# EasyEDA Pro project EthernetModule.epro

# Schematic Ethernet Mode
Board Name: Board2; Create Date: 2026-04-15; Page Name: P1; Project Name: ESP32_Buspirate_complete; Schematic Name: Ethernet Mode; Update Date: 2026-04-15; Company: EasyEDA.com; Page Size: A4; Version: V1.0
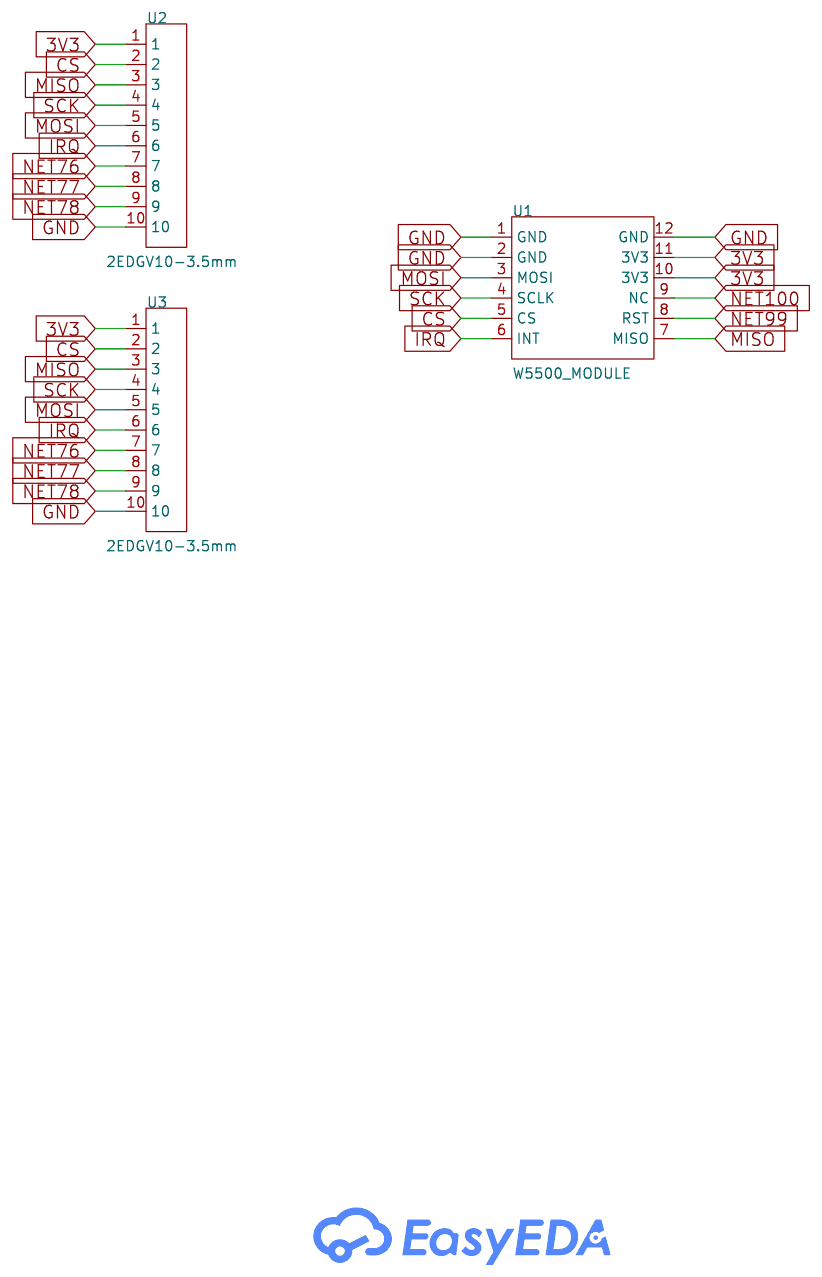
[diagram p0: schematic sheet]

## Parts
U1  W5500_MODULE  [COMM-TH_L25.0-W23.0_W5500_MODULE]
U2  2EDGV10-3.5mm  [CONN-TH_10P-P2.50_B10B-EH-A-LF-SN]
U3  2EDGV10-3.5mm  [CONN-TH_10P-P2.50_B10B-EH-A-LF-SN]

## Library data of the parts
U1 = W5500_MODULE_LAN: Supplier Part: C9900227168; JLCPCB Part Class: Extended Part; Supplier: LCSC
U2 U3 = CONN-TH_10P-P3.50: Supplier Part: C9900014909; Supplier Footprint: 2EDG_10p_3.5mm; JLCPCB Part Class: Extended Part; Supplier: LCSC

## Nets
3V3: U1.10(3V3) U1.11(3V3) U2.1 U3.1
GND: U1.1(GND) U1.2(GND) U1.12(GND) U2.10 U3.10
CS: U1.5(CS) U2.2 U3.2
IRQ: U1.6(INT) U2.6 U3.6
MISO: U1.7(MISO) U2.3 U3.3
MOSI: U1.3(MOSI) U2.5 U3.5
NET76: U2.7 U3.7
NET77: U2.8 U3.8
NET78: U2.9 U3.9
NET99: U1.8(RST)
NET100: U1.9(NC)
SCK: U1.4(SCLK) U2.4 U3.4

# Board PCB4
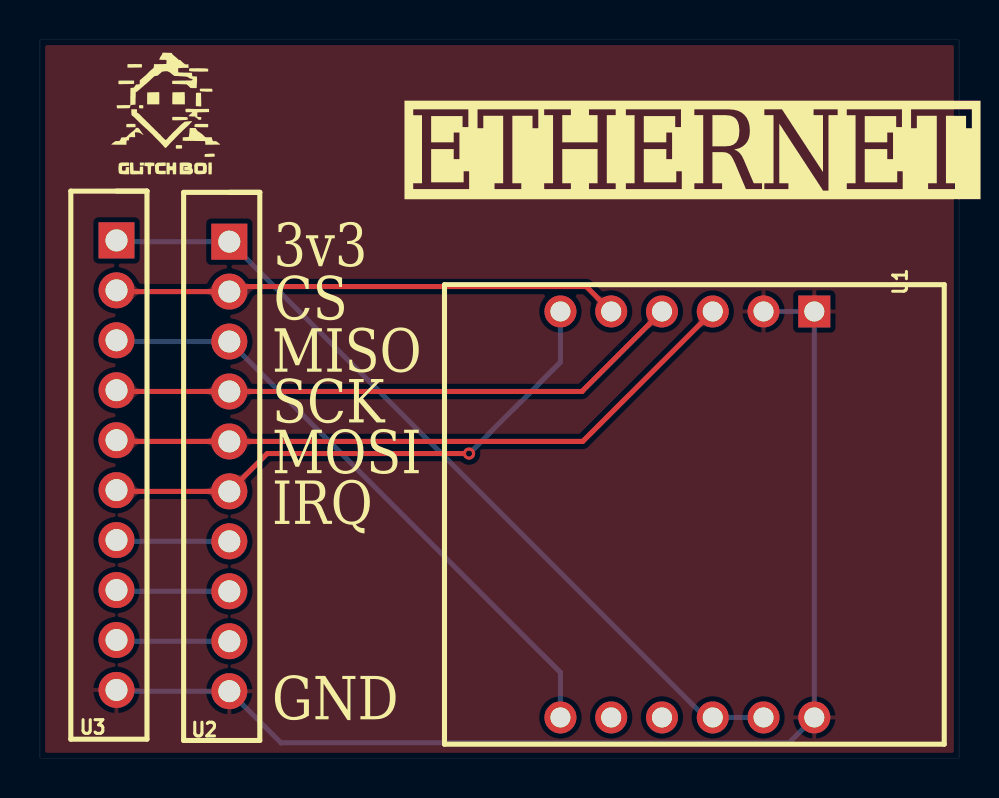
[diagram p1: board, top side]
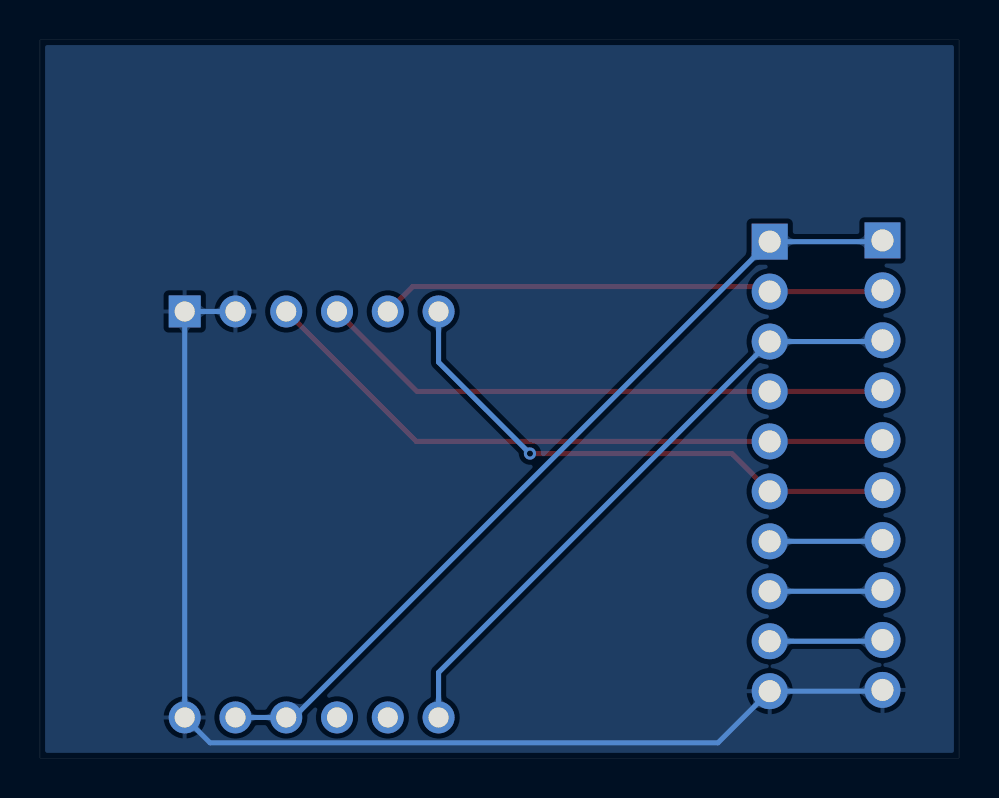
[diagram p2: board, bottom side, seen from below]

Outline 45.97 x 35.94 mm; copper layers: Top Layer, Bottom Layer. Coordinates in mm from the lower left corner of the outline.
Outline path: rectangle 0,35.94 45.97,0
Stack: Top Layer 0.035mm / Dielectric1 1.51mm FR4 er 4.5 / Bottom Layer 0.035mm

## Design rules (mm)
template: JLCPCB Capability(Two Layers Board)
spacing copperThickness1oz (default): track to track 0.102, other pairs 0.152 to 0.3
spacing copperThickness2oz: track to track 0.203, other pairs 0.152 to 0.3
track width copperThickness1oz (default): min 0.127, default 0.254, max 2.54
track width copperThickness2oz: min 0.203, default 0.254, max 2.54
differential pair differentialPair (default): width min 0.127, default 0.254, max 2.54; gap min 0.152, default 0.152
via viaSize (default): diameter min 0.5, default 0.61, max 10; hole min 0.3, default 0.305, max 6.3

## Placement (name value [footprint] x y rotation side)
U1  W5500_MODULE  [COMM-TH_L25.0-W23.0_W5500_MODULE]  32.38 12.19 270 top
U2  2EDGV10-3.5mm  [CONN-TH_10P-P2.50_B10B-EH-A-LF-SN]  9.47 14.6 270 top
U3  2EDGV10-3.5mm  [CONN-TH_10P-P2.50_B10B-EH-A-LF-SN]  3.83 14.66 270 top

## Footprints (pads in the part's own frame, mm; a bottom-side part is the same pattern mirrored in y, then rotated)
COMM-TH_L25.0-W23.0_W5500_MODULE
  rect 1.6x1.6 hole 1: 1(-10.16,6.35)
  round 1.6 hole 1: 2(-10.16,3.81) 3(-10.16,1.27) 4(-10.16,-1.27) 5(-10.16,-3.81) 6(-10.16,-6.35) 7(10.16,-6.35) 8(10.16,-3.81) 9(10.16,-1.27) 10(10.16,1.27) 11(10.16,3.81) 12(10.16,6.35)
CONN-TH_10P-P2.50_B10B-EH-A-LF-SN
  rect 1.8x1.8 hole 1.1: 1(-11.25,0)
  round 1.8 hole 1.1: 2(-8.75,0) 3(-6.25,0) 4(-3.75,0) 5(-1.25,0) 6(1.25,0) 7(3.75,0) 8(6.25,0) 9(8.75,0) 10(11.25,0)

## Nets
As in the schematic.

## Via types
v1: diameter 0.61, hole 0.305, Top Layer to Bottom Layer, 1 via

## Routing (per net, layer and track width the routed paths; a pad name or vN(x,y) marks a point on that pad's centre or on a via; arc(x,y) is an arc through that point)
3V3: length 42.3
  Bottom Layer w0.254: U1.11 U1.10 33.29,2.03 U2.1 3.89,25.85 U3.1
GND: length 59.4
  Bottom Layer w0.254: U3.10 3.89,3.35 U2.10 12.06,0.76 37.47,0.76 U1.12 U1.1 U1.2
CS: length 25.4
  Top Layer w0.254: U1.5 27.33,23.6 9.73,23.6 U2.2 3.89,23.35 U3.2
IRQ: length 27.5
  Top Layer w0.254: v1(21.46,15.24) 11.36,15.24 U2.6 3.89,13.35 U3.6
  Bottom Layer w0.254: v1(21.46,15.24) 26.03,19.81 U1.6
MISO: length 31.3
  Bottom Layer w0.254: U3.3 3.89,20.85 U2.3 26.03,4.28 U1.7
MOSI: length 32.5
  Top Layer w0.254: U3.5 3.89,15.85 U2.5 27.15,15.85 U1.3
NET76: length 5.7
  Bottom Layer w0.254: U3.7 3.89,10.85 U2.7
NET77: length 5.7
  Bottom Layer w0.254: U2.8 3.89,8.35 U3.8
NET78: length 5.7
  Bottom Layer w0.254: U2.9 3.89,5.85 U3.9
SCK: length 29
  Top Layer w0.254: U1.4 27.11,18.35 U2.4 3.89,18.35 U3.4

## Copper pours and planes (outline as drawn; the poured copper is in the pictures)
GND on Top Layer: 0,35.94 45.97,35.94 45.97,0 0,0
GND on Bottom Layer: 0,35.94 45.97,35.94 45.97,-0.13 0,-0.13

Small or netless copper shapes (teardrops, artwork), in the pictures only: 15 on Top Layer, 26 on Bottom Layer

## Text on the board
Top Silkscreen Layer: MISO | SCK | MOSI | IRQ | GND | 3v3 | CS | ETHERNET
